# EAGLE design LoadCellAmp (EAGLE 6.5.0)
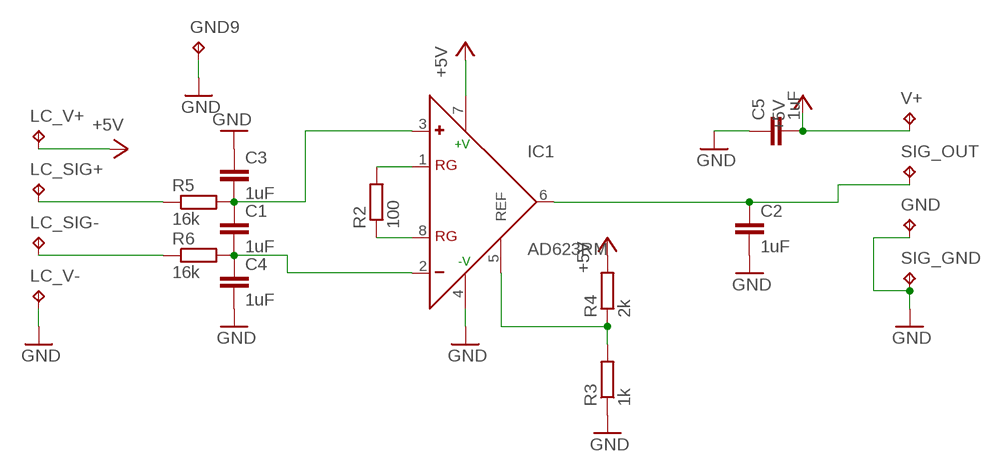
[diagram p0: schematic, sheet 1]

## Parts
C1  1uF  C-EUC0805  [C0805]
C2  1uF  C-EUC0805  [C0805]
C3  1uF  C-EUC0805  [C0805]
C4  1uF  C-EUC0805  [C0805]
C5  1uF  C-EUC0805  [C0805]
GND  TPB1,27  [B1,27]
GND9  TPB1,27  [B1,27]
IC1  AD623RM  [MSOP08]
LC_SIG+  TPB1,27  [B1,27]
LC_SIG-  TPB1,27  [B1,27]
LC_V+  TPB1,27  [B1,27]
LC_V-  TPB1,27  [B1,27]
R2  100  R-EU_R0805  [R0805]
R3  1k  R-EU_R0805  [R0805]
R4  2k  R-EU_R0805  [R0805]
R5  16k  R-EU_R0805  [R0805]
R6  16k  R-EU_R0805  [R0805]
SIG_GND  TPB1,27  [B1,27]
SIG_OUT  TPB1,27  [B1,27]
V+  TPB1,27  [B1,27]

## Nets
+5V: C5.2 IC1.7(+V) LC_V+.TP R4.2 V+.TP
GND: C2.2 C3.1 C4.2 C5.1 GND9.TP GND.TP IC1.4(-V) LC_V-.TP R3.1 SIG_GND.TP
N$1: IC1.1(RG) R2.2
N$2: IC1.8(RG) R2.1
N$3: IC1.5(REF) R3.2 R4.1
N$5: C2.1 IC1.6(OUT) SIG_OUT.TP
N$6: LC_SIG+.TP R5.1
N$7: LC_SIG-.TP R6.1
N$8: C1.1 C3.2 IC1.3(+) R5.2
N$9: C1.2 C4.1 IC1.2(-) R6.2

## Library data of the parts
C1-C5 = resistor:C-EU: CAPACITOR, European symbol
GND GND9 LC_SIG+ LC_SIG- LC_V+ LC_V- SIG_GND SIG_OUT V+ = testpad:TP: Test pad
IC1 = analog-devices:AD623: Single-Supply, Rail-to-Rail, Low Cost Instrumentation Amplifier Source: http://www.analog.com/static/imported-files/data_sheets/AD623.pdf; MPN: AD623ARMZ; OC_FARNELL: 1660961; OC_NEWARK: 19M8824
R2-R6 = rcl:R-EU_: RESISTOR, European symbol

## Board
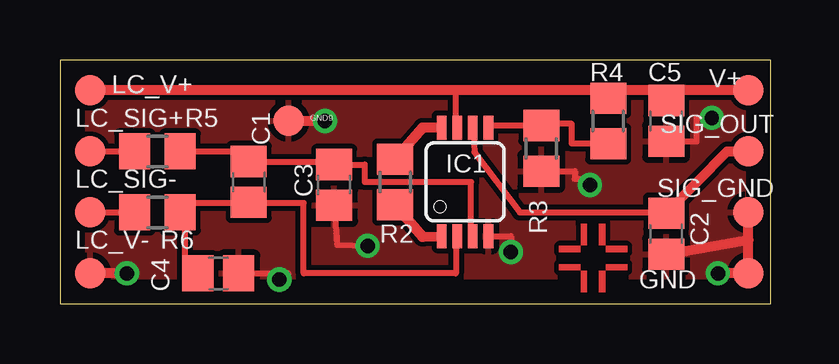
[diagram p1: board, top side]
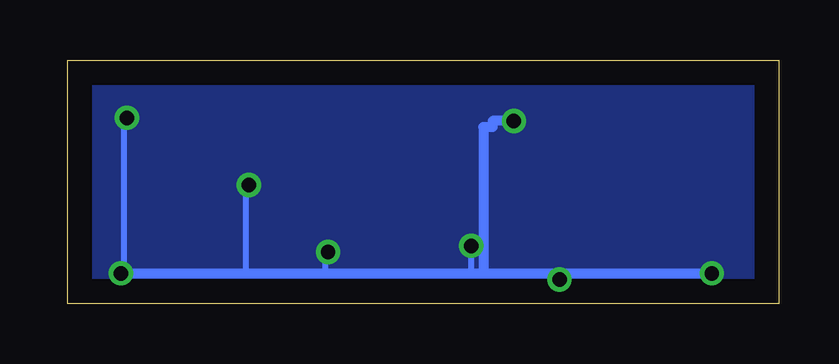
[diagram p2: board, bottom side, seen from below]

Size 29.64 x 10.15 mm. Coordinates in mm from the lower left corner, seen from the top.
Outline: 0,0 29.64,0 29.64,10.15 0,10.15 0,0
Copper layers (1*16): Top 0.035mm / dielectric 1.5mm / Bottom 0.035mm
Design rules "default": minimum track width 10mil, minimum drill 24mil, track to track 8mil, track to pad 8mil, pad to pad 8mil, via to via 8mil, smd to smd 8mil, copper to edge 40mil, drill to drill 8mil, minimum pad ring 10mil, minimum via ring 8mil, stop-mask expansion 4mil, vias tented up to drill 0mil, thermal gap 10mil

### Footprints (pad centres in the part's own frame; a part is rotated, then mirrored left to right if it is on the bottom)
C0805 = smd 1.3 x 1.5: 1 -0.85,0; 2 0.85,0
B1,27 = smd 1.27 x 1.27: TP 0,0
MSOP08 = smd 0.4 x 1: 1 -0.976,-2.263; 2 -0.326,-2.263; 3 0.324,-2.263; 4 0.974,-2.263; 5 0.974,2.262; 6 0.324,2.262; 7 -0.326,2.262; 8 -0.976,2.262
R0805 = smd 1.3 x 1.5: 1 -0.95,0; 2 0.95,0

### Placement (x,y rotation side)
C1  7.87,5.08 270 top
C2  25.27,2.92 270 top
C3  11.43,4.95 90 top
C4  6.6,1.27 0 top
C5  25.27,7.62 90 top
GND  28.7,1.27 0 top
GND9  9.52,7.62 0 top
IC1  16.89,5.08 0 top
LC_SIG+  1.27,6.35 0 top
LC_SIG-  1.27,3.81 0 top
LC_V+  1.27,8.89 0 top
LC_V-  1.27,1.27 0 top
R2  13.97,5.08 270 top
R3  20.07,6.48 90 top
R4  22.86,7.62 90 top
R5  4.06,6.35 0 top
R6  4.06,3.81 0 top
SIG_GND  28.7,3.81 0 top
SIG_OUT  28.7,6.35 0 top
U$2  [PASSER]  22.23,1.91 0 top
V+  28.7,8.89 0 top

### Tracks (layer width: path | path; a pad name or v marks a point on that pad's centre or on a via)
+5V
  Top 0.254: IC1.7 16.51,7.34 16.51,8.89 | R4.2 22.86,8.89
  Top 0.406: V+.TP 25.27,8.89 | 25.27,8.89 22.86,8.89 16.51,8.89 LC_V+.TP | C5.2 25.27,8.89
GND  (via drill 0.6)
  Top 0.254: C5.1 26.54,6.77 26.54,7.75 v27.18,7.75 | R3.1 21.46,5.53 21.46,5.21 22.1,5.21 v22.1,4.95 | IC1.4 18.8,2.82 v18.8,2.16 | C3.1 11.56,2.45 v12.83,2.41 | C4.2 9.52,1.27 v9.14,1.02
  Top 0.406: v27.43,1.27 GND.TP 28.7,2.67 | v2.79,1.27 LC_V-.TP | C2.2 28.7,2.67 | 28.7,2.67 SIG_GND.TP | GND9.TP v11.05,7.62
  Bottom 0.254: v27.18,7.75 27.3,7.75 27.3,1.27 | v22.1,4.95 22.23,4.95 22.23,1.27 | v18.8,2.16 18.92,2.16 18.92,1.27 | v12.83,2.41 12.83,1.27 | v9.14,1.02 9.91,1.27
  Bottom 0.406: v27.43,1.27 27.3,1.27 22.23,1.27 18.92,1.27 12.83,1.27 12.32,1.27 | 12.32,1.27 9.91,1.27 v2.79,1.27 | v11.05,7.62 11.94,7.62 11.94,7.37 12.32,7.37 12.32,1.27
  pour Bottom: 0.13,10.03 0.13,0.13 29.59,0.13 29.59,10.03
  pour Top: 0.13,10.03 0.13,0.13 29.59,0.13 29.59,10.03
N$1
  Top 0.406: R2.2 15.11,2.79 15.15,2.79 IC1.1
N$2
  Top 0.406: IC1.8 15.11,7.34 R2.1
N$3
  Top 0.254: R4.1 21.34,6.67 21.34,7.49 20.07,7.49 R3.2 17.86,7.43 IC1.5
N$5
  Top 0.254: IC1.6 17.27,6.33 19.18,3.81 25.27,3.81 24.64,4.19 25.78,4.19 C2.1
  Top 0.406: C2.1 27.81,6.35 SIG_OUT.TP
N$6
  Top 0.254: LC_SIG+.TP R5.1
N$7
  Top 0.254: LC_SIG-.TP R6.1
N$8
  Top 0.254: R5.2 7.87,6.35 C1.1 11.43,5.93 C3.2 12.7,5.8 12.7,5.08 17.14,5.08 17.14,2.82 IC1.3
N$9
  Top 0.254: IC1.2 16.51,2.82 16.51,1.27 10.16,1.27 10.16,4.19 7.87,4.19 | 7.87,4.19 C1.2 | 7.87,4.19 5.01,4.19 R6.2 5.21,3.81 5.21,1.27 C4.1